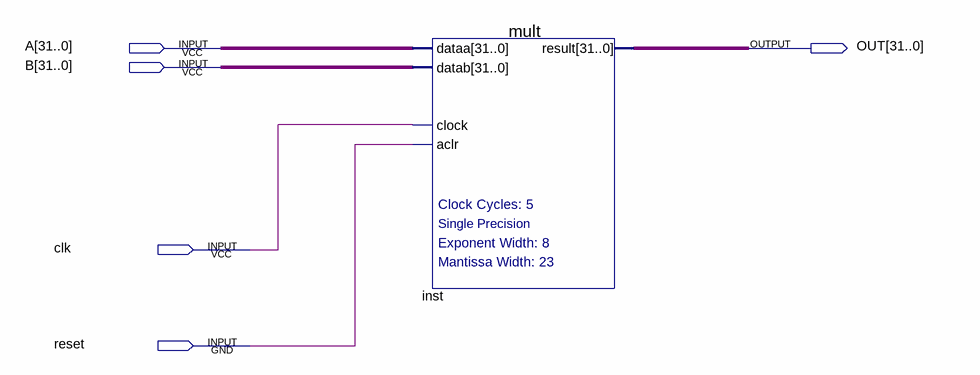
[diagram p0: schematic sheet]
// Quartus schematic MULT.bdf as structural Verilog: 1 symbols, 5 pins
module MULT (
  input  [31:0] A,
  input  [31:0] B,
  input  clk,
  input  reset,
  output [31:0] OUT
);

  mult inst (.dataa(A), .datab(B), .clock(clk), .aclr(reset), .result(OUT));
endmodule
